# EAGLE design BendSensor (EAGLE 7.4.0)
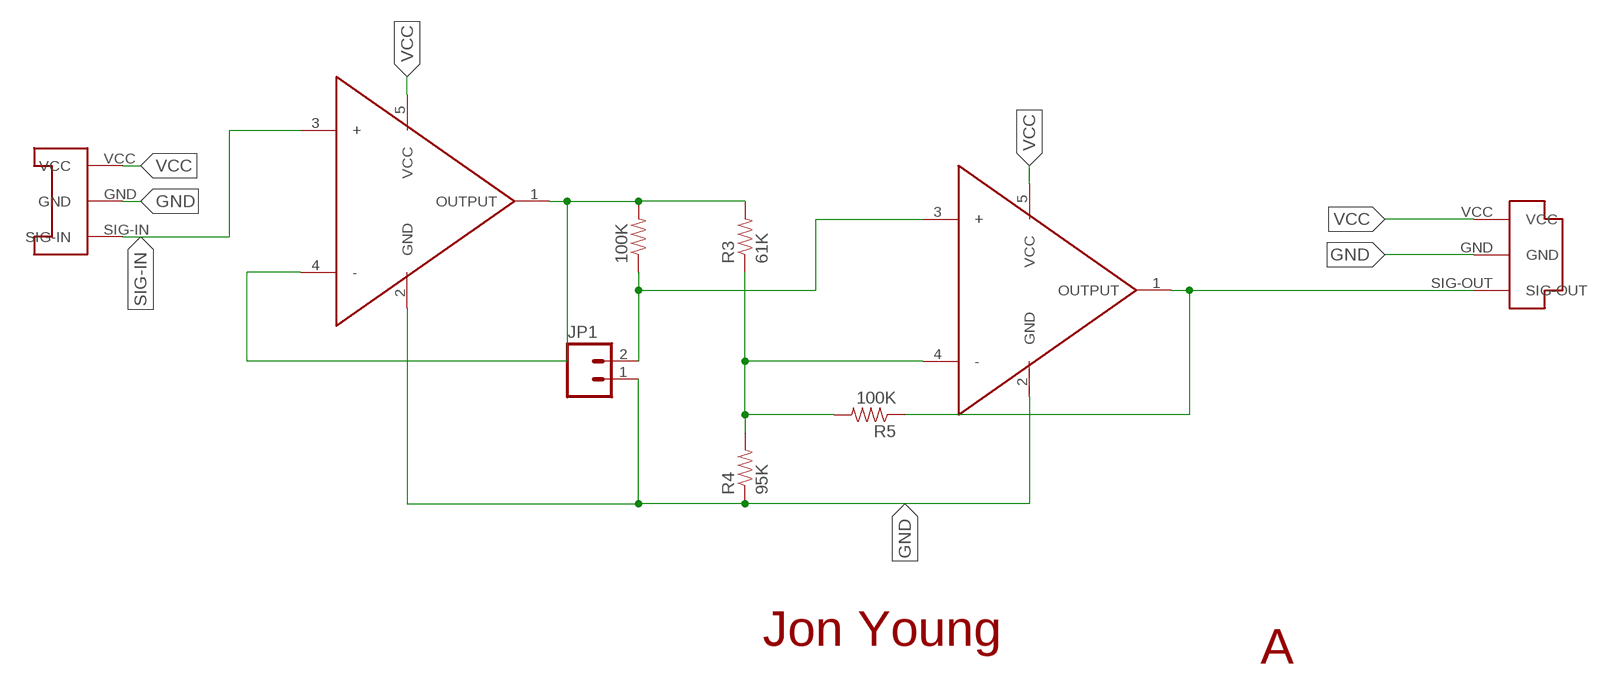
[diagram p0: schematic, sheet 1]

## Parts
100K  RESISTOR0603  [0603-RES]
JP1  M02PTH3  [1X02_LONGPADS]
R3  61K  RESISTOR0603  [0603-RES]
R4  95K  RESISTOR0603  [0603-RES]
R5  100K  RESISTOR0603  [0603-RES]
U$1  CONN-PLUG-3POS-3MM  [PLUG-3POS-3MM-SMD]
U$2  CONN-SOCKET-3POS-3MM  [SOCKET-3POS-3MM-SMD]
U$3  OPAMP-MCP6001SOT23-5  [SOT23-5]
U$4  OPAMP-MCP6001SOT23-5  [SOT23-5]

## Nets
GND: JP1.1 R4.1 U$1.GND U$2.GND U$3.2(GND) U$4.2(GND)
N$5: R5.1 U$1.SIG-OUT U$4.1(OUTPUT)
N$6: R3.1 R4.2 R5.2 U$4.4(-)
N$8: 100K.2 R3.2 U$3.1(OUTPUT) U$3.4(-)
N$9: 100K.1 JP1.2 U$4.3(+)
SIG-IN: U$2.SIG-IN U$3.3(+)
VCC: U$1.VCC U$2.VCC U$3.5(VCC) U$4.5(VCC)

## Notes on the sheet
- Jon Young
- A

## Library data of the parts
100K R3-R5 = SparkFun-Resistors:RESISTOR: Resistor Basic schematic elements and footprints for 0603, 1206, and PTH resistors.
JP1 = SparkFun-Connectors:M02: Standard 2-pin 0.1" header. Use with - straight break away headers ( PRT-00116) - right angle break away headers (PRT-00553) - swiss pins (PRT-00743) - machine pins (PRT-00117) - female headers (PRT-00115) Molex polarized connector foot print use with: PRT-08233 with associated crimp pins and housings. 2.54_SCREWTERM for use with PRT-10571. 3.5mm Screw Terminal footprints for PRT-08084 5mm Screw Terminal footprints for use with PRT-08432
U$1 = EmbeddedPlayground:CONN-PLUG-3POS-3MM: Surface mount board to board connector. Female socket, 3 position.
U$2 = EmbeddedPlayground:CONN-SOCKET-3POS-3MM: Surface mount board to board connector. Female socket, 3 position.
U$3 U$4 = EmbeddedPlayground:OPAMP-MCP6001

## Board
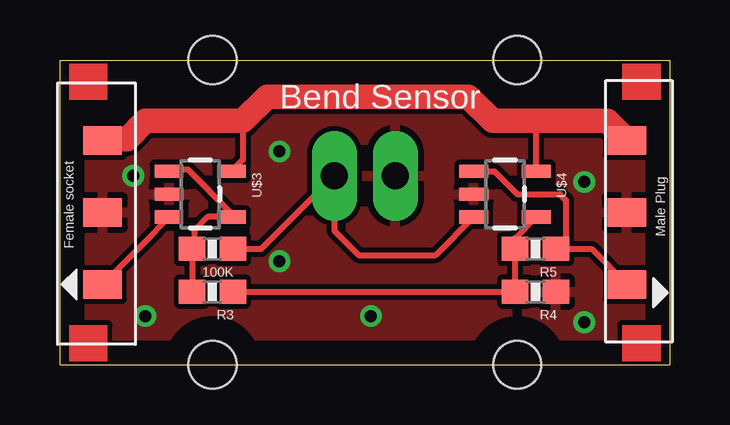
[diagram p1: board, top side]
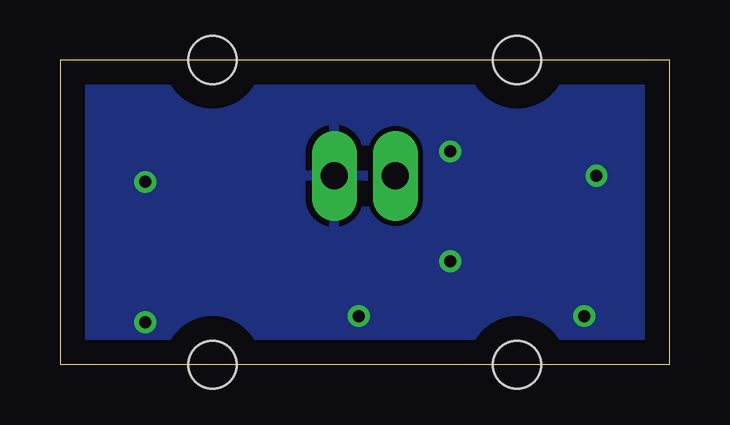
[diagram p2: board, bottom side, seen from below]

Size 25.4 x 12.7 mm. Coordinates in mm from the lower left corner, seen from the top.
Outline: 0,0 25.4,0 25.4,12.7 0,12.7 0,0
Copper layers (1*16): Top 0.035mm / dielectric 1.5mm / Bottom 0.035mm
Design rules "default": minimum track width 10mil, minimum drill 24mil, track to track 8mil, track to pad 8mil, pad to pad 8mil, via to via 8mil, smd to smd 8mil, copper to edge 40mil, drill to drill 8mil, minimum pad ring 10mil, minimum via ring 8mil, stop-mask expansion 4mil, vias tented up to drill 0mil, thermal gap 10mil
Holes 2 mm at 6.35,0 6.35,12.7 19.05,12.7 19.05,0

### Footprints (pad centres in the part's own frame; a part is rotated, then mirrored left to right if it is on the bottom)
0603-RES = smd 1.1 x 1: 1 -0.85,0; 2 0.85,0
1X02_LONGPADS = drill 1.118 pad 1.88 long: 1 0,0; 2 2.54,0
PLUG-3POS-3MM-SMD = smd 1.2 x 1.6: GND 0,0; SIG-OUT 3,0; VCC -3,0
SOCKET-3POS-3MM-SMD = smd 1.2 x 1.6: GND 0,0; SIG-IN -3,0; VCC 3,0
SOT23-5 = smd 0.55 x 1.2: 1 -0.95,-1.3; 2 0,-1.3; 3 0.95,-1.3; 4 0.95,1.3; 5 -0.95,1.3

### Placement (x,y rotation side)
100K  6.35,4.83 180 top
JP1  13.97,7.87 180 top
R3  6.35,3.05 180 top
R4  19.81,3.05 180 top
R5  19.81,4.83 180 top
U$1  23.62,6.35 270 top
U$2  1.78,6.35 90 top
U$3  5.84,7.11 270 top
U$4  18.54,7.11 270 top

### Tracks (layer width: path | path; a pad name or v marks a point on that pad's centre or on a via)
GND  (via drill 0.5)
  other vias: 3.05,7.87 21.84,7.62 9.14,8.89 21.84,1.78 9.14,4.32 12.95,2.03 3.56,2.03
  pour Top: -1.27,13.91 -1.02,-1.27 29.37,-1.27 29.12,13.91
  pour Bottom: -1.27,13.91 26.58,13.91 26.58,-1.27 -1.27,-1.27
N$5
  Top 0.254: 23.57,3.3 U$1.SIG-OUT 22.15,4.83 R5.1 21.08,5.25 21.08,6.86 20.83,7.11 19.05,7.11 18.1,8.06 U$4.1
N$6
  Top 0.254: R3.1 R4.2 R5.2 18.96,5.28 U$4.4
N$8
  Top 0.254: U$3.1 4.61,8.13 5.33,8.13 7.14,6.32 U$3.4 6.16,6.16 5.59,5.59 5.59,4.91 100K.2 R3.2
N$9
  Top 0.254: 100K.1 8.38,4.83 JP1.2 11.43,5.59 12.45,4.57 15.65,4.57 U$4.3
SIG-IN
  Top 0.254: U$3.3 3.83,5.4 U$2.SIG-IN
VCC
  Top 0.254: 7.62,10.16 7.62,8.54 U$3.5 | U$4.5 19.84,9.94
  Top 0.406: 19.84,9.94 20.07,10.16
  Top 1.016: U$2.VCC 1.83,9.4 2.79,9.4 3.56,10.16 7.62,10.16 8.64,11.18 17.02,11.18 18.03,10.16 20.07,10.16 22.81,10.16 U$1.VCC

### Text on the board
tPlace: Bend Sensor